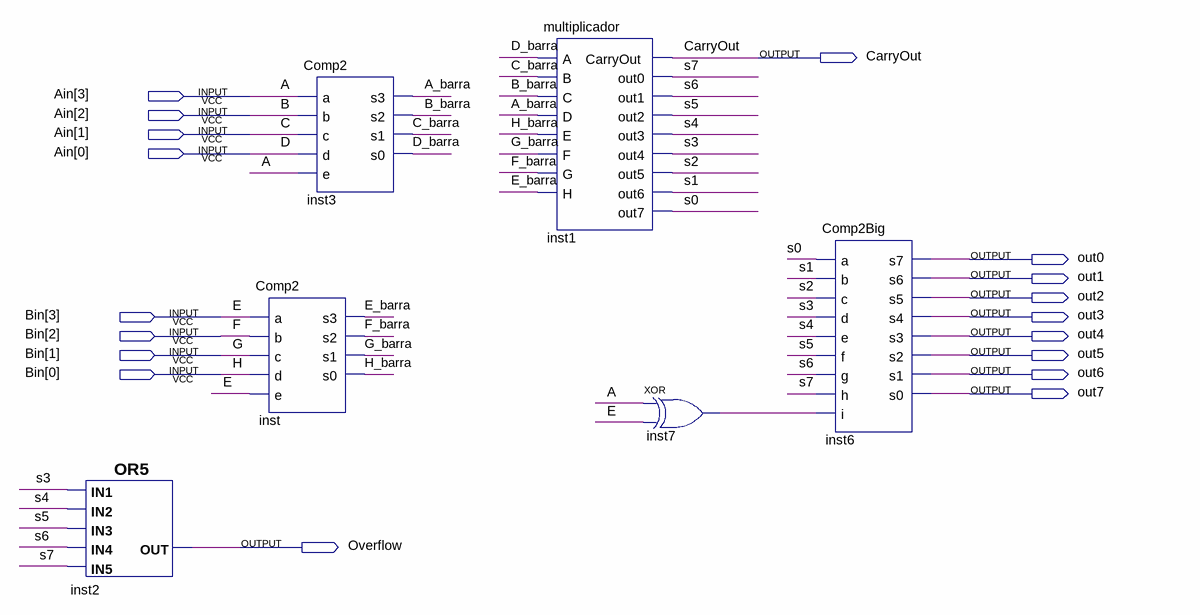
[diagram p0: schematic sheet]
// Quartus schematic Multcomsinal.bdf as structural Verilog: 6 symbols, 18 pins
module Multcomsinal (
  input  [3:0] Ain,
  input  [3:0] Bin,
  output CarryOut,
  output out0,
  output out1,
  output out2,
  output out3,
  output out4,
  output out5,
  output out6,
  output out7,
  output Overflow
);

  wire A_barra, B_barra, C_barra, D_barra, E_barra, F_barra, G_barra, H_barra, inst7_out, s0, s1, s2, s3, s4,
       s5, s6, s7;

  or inst2 (Overflow, s3, s4, s5, s6, s7);
  Comp2 inst3 (
    .a(Ain[3]), .b(Ain[2]), .c(Ain[1]), .d(Ain[0]), .e(Ain[3]), .s3(A_barra), .s2(B_barra), .s1(C_barra),
    .s0(D_barra));
  Comp2 inst (
    .a(Bin[3]), .b(Bin[2]), .c(Bin[1]), .d(Bin[0]), .e(Bin[3]), .s3(E_barra), .s2(F_barra), .s1(G_barra),
    .s0(H_barra));
  multiplicador inst1 (
    .A(D_barra), .B(C_barra), .C(B_barra), .D(A_barra), .E(H_barra), .F(G_barra), .G(F_barra), .H(E_barra),
    .CarryOut(CarryOut), .out0(s7), .out1(s6), .out2(s5), .out3(s4), .out4(s3), .out5(s2), .out6(s1),
    .out7(s0));
  xor inst7 (inst7_out, Ain[3], Bin[3]);
  Comp2Big inst6 (
    .a(s0), .b(s1), .c(s2), .d(s3), .e(s4), .f(s5), .g(s6), .h(s7), .i(inst7_out), .s7(out0), .s6(out1),
    .s5(out2), .s4(out3), .s3(out4), .s2(out5), .s1(out6), .s0(out7));

  // Other names for the same wires on the sheet: A = Ain[3]; B = Ain[2]; C = Ain[1]; D = Ain[0]; E = Bin[3];
  //   F = Bin[2]; G = Bin[1]; H = Bin[0]
endmodule
